# Altium schematic sheet HHT_CAL_PWR_3.1_20170407.SchDoc
size A1
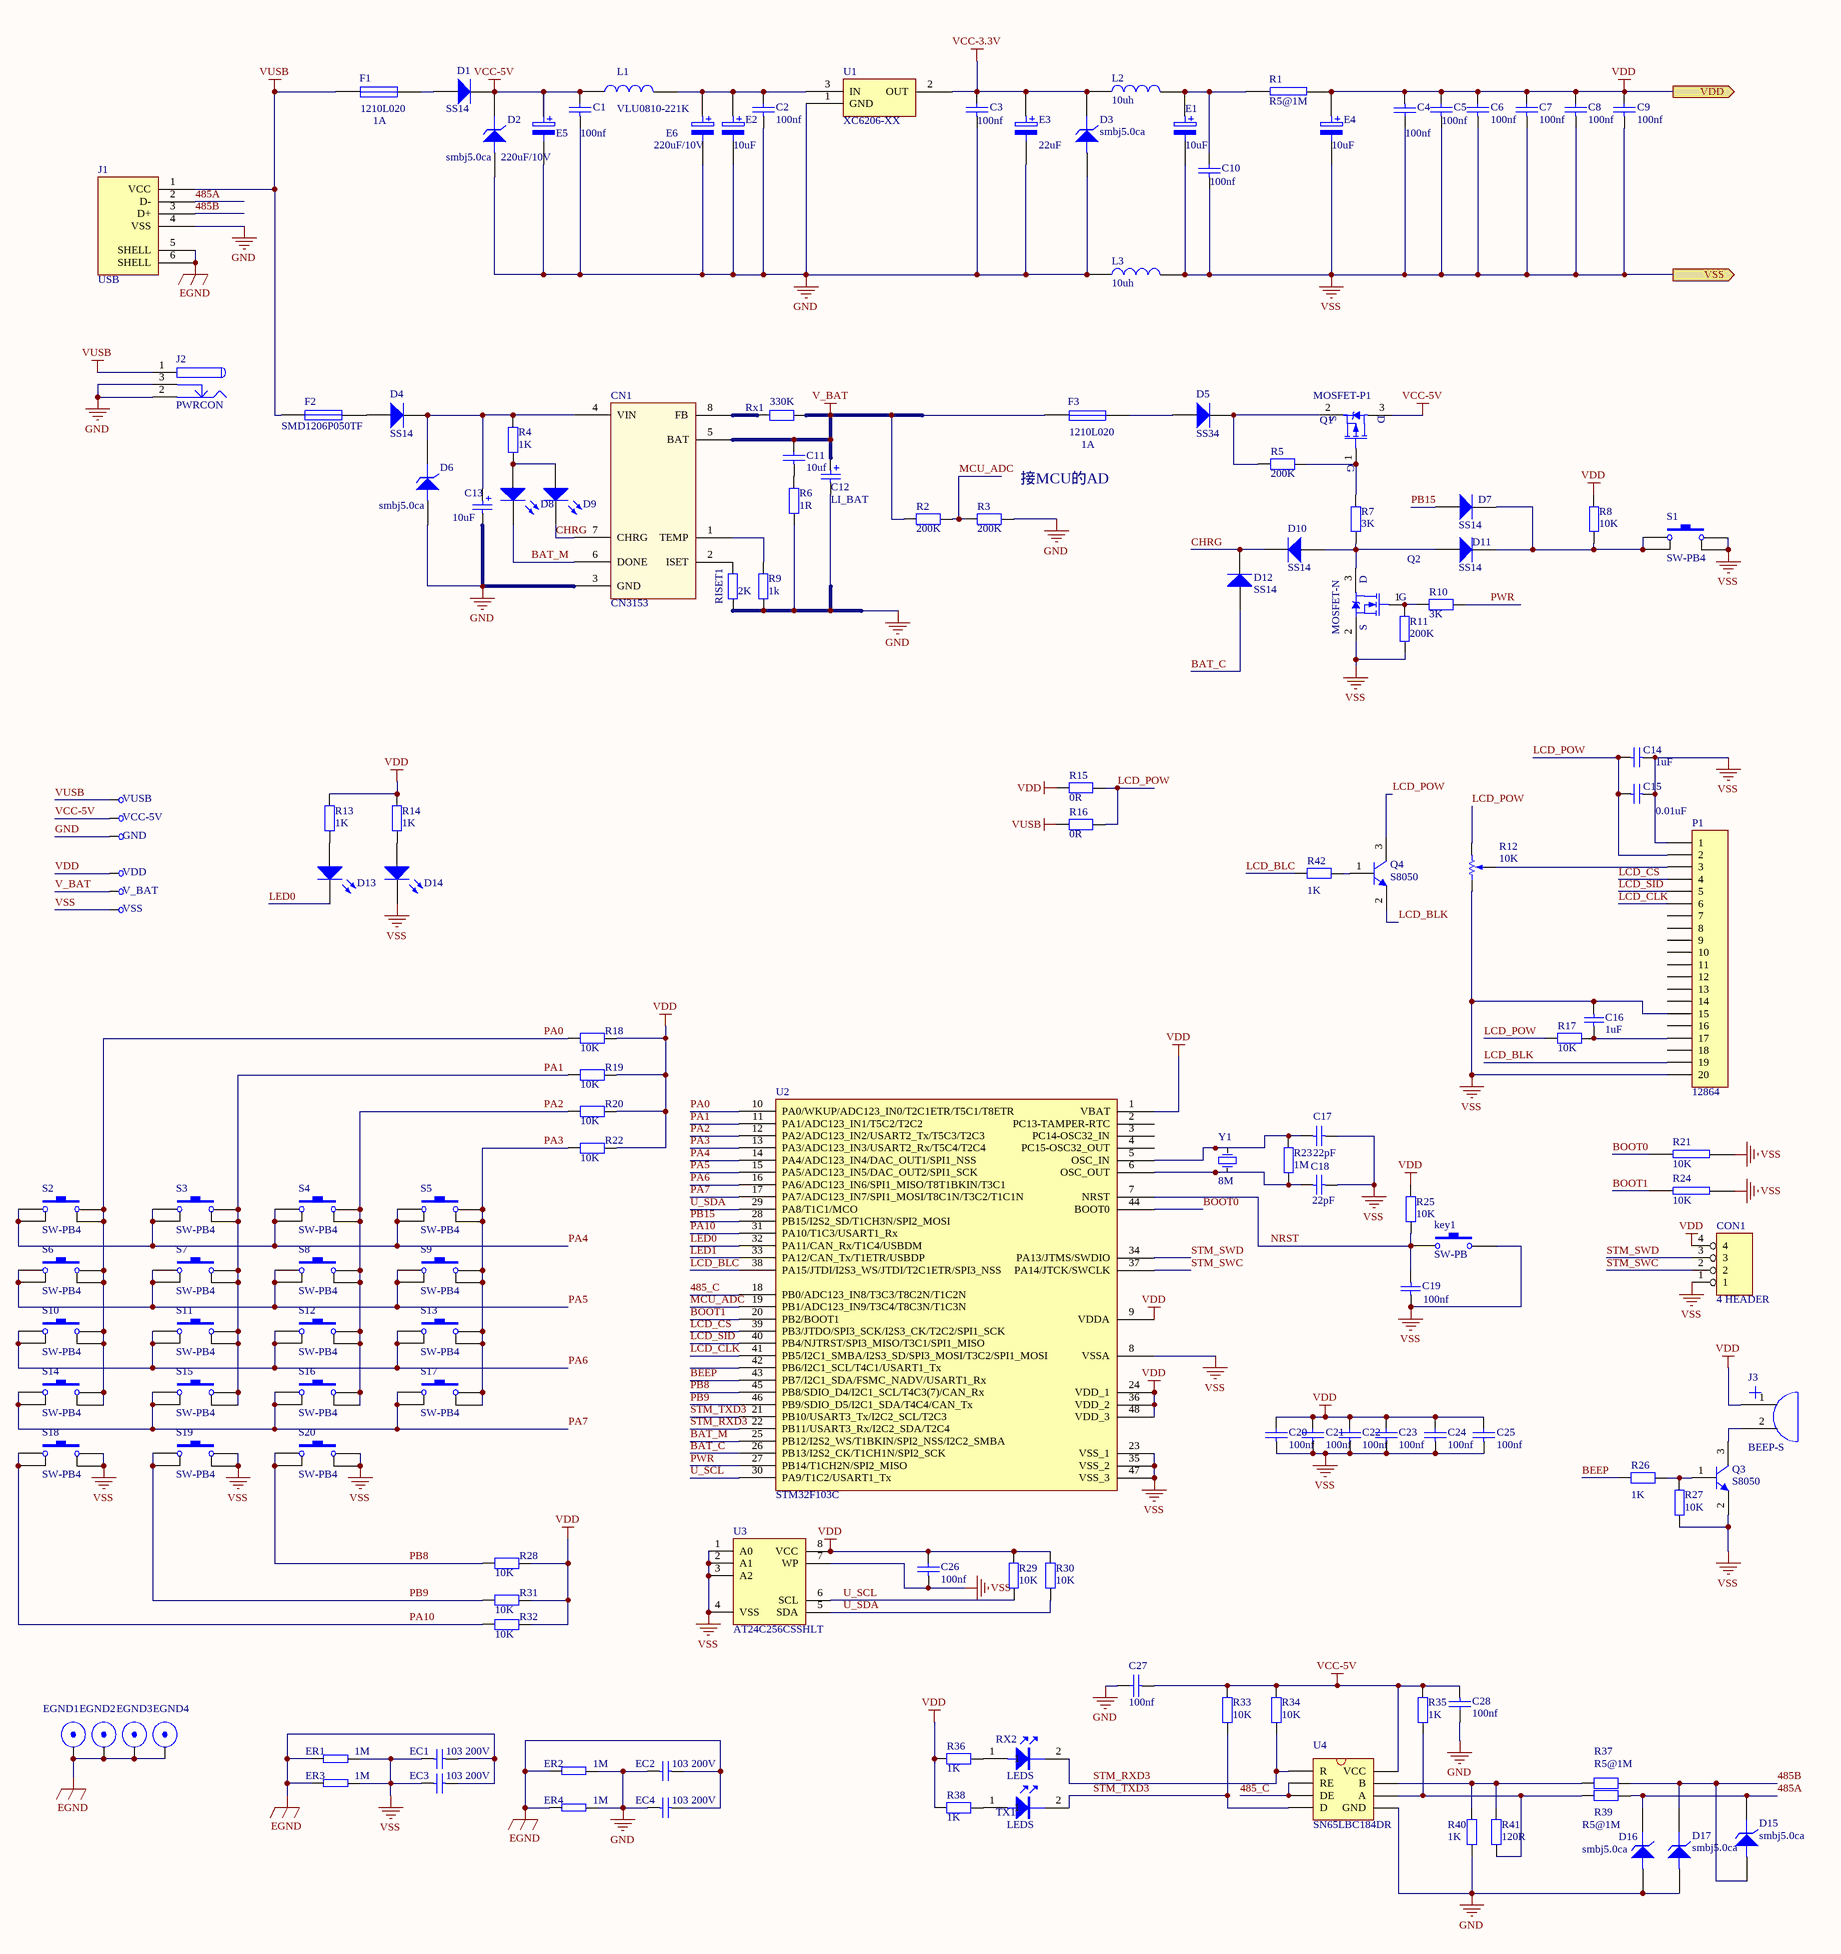
[diagram p0: HHT_CAL_PWR_3.1_20170407.SchDoc]

## Parts
C1  100nf  [LC-0805_C]
C2  100nf  [LC-0603_C]
C3  100nf  [LC-0603_C]
C4  100nf  [LC-0603_C]
C5  100nf  [LC-0603_C]
C6  100nf  [LC-0603_C]
C7  100nf  [LC-0603_C]
C8  100nf  [LC-0603_C]
C9  100nf  [LC-0603_C]
C10  100nf  [LC-0603_C]
C11  10uf  [LC-CASE-A_3216]
C12  LI_BAT  [HDR2X1-2.54]
C13  value 10uF  [LC-CASE-B_3528]  (hidden comment: 100uF)
C14  1uf  [LC-0603_C]
C15  0.01uF  [LC-0603_C]
C16  1uF  [LC-0603_C]
C17  22PF  [LC-0603_C]
C18  22PF  [LC-0603_C]
C19  100nf  [LC-0603_C]
C20  100nf  [LC-0603_C]
C21  100nf  [LC-0603_C]
C22  100nf  [LC-0603_C]
C23  100nf  [LC-0603_C]
C24  100nf  [LC-0603_C]
C25  100nf  [LC-0603_C]
C26  100nf  [LC-0603_C]
C27  100nf  [LC-0603_C]
C28  100nf  [LC-0603_C]
CN1  CN3153  [SOIC8]
CON1  4 HEADER  [sip4]
D1  SS14  [LC-SMA(DO-214AC)_S5]
D2  smbj5.0ca  [LC-SMB(DO-214AA)_S1]
D3  smbj5.0ca  [LC-SMB(DO-214AA)_S1]
D4  SS14  [LC-SMA(DO-214AC)_S5]
D5  SS34  [LC-SMA(DO-214AC)_S5]
D6  smbj5.0ca  [LC-SMA(DO-214AC)_S5]
D7  SS14  [LC-SMA(DO-214AC)_S5]
D8  LED0  [LED-0805]  (value not drawn)
D9  LED0  [LED-0805]  (value not drawn)
D10  SS14  [LC-SMA(DO-214AC)_S5]
D11  SS14  [LC-SMA(DO-214AC)_S5]
D12  SS14  [LC-SMA(DO-214AC)_S5]
D13  LED0  [LC-0805_LED_S1]  (value not drawn)
D14  LED0  [LC-0805_LED_S1]  (value not drawn)
D15  smbj5.0ca  [LC-SMB(DO-214AA)_S1]
D16  smbj5.0ca  [LC-SMB(DO-214AA)_S1]
D17  smbj5.0ca  [LC-SMB(DO-214AA)_S1]
E1  10uF  [LC-CASE-A_3216]
E2  10uF  [LC-CASE-B_3528]
E3  22uF  [HONOR_63X54]
E4  10uF  [LC-CASE-A_3216]
E5  220uF/10V  [HONOR_63X54]
E6  220uF/10V  [HONOR_63X54]
EC1  103 200V  [LC-1206_C]
EC2  103 200V  [LC-1206_C]
EC3  103 200V  [LC-1206_C]
EC4  103 200V  [LC-1206_C]
EGND1  EGND  [H-6-3.2m]  (value not drawn)
EGND2  EGND  [H-6-3.2m]  (value not drawn)
EGND3  EGND  [H-6-3.2m]  (value not drawn)
EGND4  EGND  [H-6-3.2m]  (value not drawn)
ER1  1M  [LC-1206_R]
ER2  1M  [LC-1206_R]
ER3  1M  [LC-1206_R]
ER4  1M  [LC-1206_R]
F1  1210L020  value 1A  [LC-0805_R]
F2  SMD1206P050TF  [LC-1206_R]
F3  1210L020  value 1A  [LC-0805_R]
GND  CHECK  [CHECK-B]  (value not drawn)
J1  USB  [USB-4-A]
J2  PWRCON  [DC-005]
J3  BEEP-S  [BEEP-S]
key1  SW-PB  [SW_PB2_C1]
L1  VLU0810-221K  [L-SMD-7]
L2  10uh  [LC-0805_L]
L3  10uh  [LC-0805_L]
P1  12864  [HDR1X20]
Q1  MOSFET-P1  [SOT23-3]
Q2  MOSFET-N  [LC-SOT-23(SOT-23-3)]
Q3  S8050  [SOT23-3]
Q4  S8050  [SOT23-3]
R1  R5@1M  [LC-0805_R]
R2  200K  [LC-0603_R]
R3  200K  [LC-0603_R]
R4  1K  [LC-0603_R]
R5  200K  [LC-0603_R]
R6  1R  [LC-0603_R]
R7  3K  [LC-0603_R]
R8  10K  [LC-0603_R]
R9  1k  [LC-0603_R]
R10  3K  [LC-0603_R]
R11  200K  [LC-0603_R]
R12  value 10K  [VR-3296W]  (hidden comment: RPot)
R13  1K  [0805-1]
R14  1K  [0805-1]
R15  0R  [LC-0805_R]
R16  0R  [LC-0805_R]
R17  10K  [0603-1]
R18  10K  [LC-0603_R]
R19  10K  [LC-0603_R]
R20  10K  [LC-0603_R]
R21  10K  [LC-0603_R]
R22  10K  [LC-0603_R]
R23  1M  [0603-1]
R24  10K  [LC-0603_R]
R25  10K  [LC-0603_R]
R26  1K  [LC-0603_R]
R27  10k  [LC-0603_R]
R28  10K  [LC-0603_R]
R29  10K  [LC-0603_R]
R30  10K  [LC-0603_R]
R31  10K  [LC-0603_R]
R32  10K  [LC-0603_R]
R33  10K  [LC-0603_r]
R34  10K  [LC-0603_r]
R35  1K  [LC-0603_R]
R36  1K  [LC-0603_R]
R37  R5@1M  [LC-0805_R]
R38  1K  [LC-0603_R]
R39  R5@1M  [LC-0805_R]
R40  1K  [LC-0603_R]
R41  120R  [LC-0603_R]
R42  1K  [LC-0603_R]
RISET1  2K  [LC-0603_R]
Rx1  330K  [LC-0603_R]
RX2  LEDS  [LC-0805_LED_S1]
S1  SW-PB4  [金属轻触开关]
S2  SW-PB4  [金属轻触开关]
S3  SW-PB4  [金属轻触开关]
S4  SW-PB4  [金属轻触开关]
S5  SW-PB4  [金属轻触开关]
S6  SW-PB4  [金属轻触开关]
S7  SW-PB4  [金属轻触开关]
S8  SW-PB4  [金属轻触开关]
S9  SW-PB4  [金属轻触开关]
S10  SW-PB4  [金属轻触开关]
S11  SW-PB4  [金属轻触开关]
S12  SW-PB4  [金属轻触开关]
S13  SW-PB4  [金属轻触开关]
S14  SW-PB4  [金属轻触开关]
S15  SW-PB4  [金属轻触开关]
S16  SW-PB4  [金属轻触开关]
S17  SW-PB4  [金属轻触开关]
S18  SW-PB4  [金属轻触开关]
S19  SW-PB4  [金属轻触开关]
S20  SW-PB4  [金属轻触开关]
TX1  LEDS  [LC-0805_LED_S1]
U1  XC6206-XX  [LC-SOT-23(SOT-23-3)]
U2  STM32F103C  [LC-LQFP-48_7x7x05P]
U3  AT24C256CSSHLT  [SOIC-8]
U4  SN65LBC184DR  [soic-8]
V_BAT  CHECK  [CHECK-B]  (value not drawn)
VCC-5V  CHECK  [CHECK-B]  (value not drawn)
VDD  CHECK  [CHECK-B]  (value not drawn)
VSS  CHECK  [CHECK-B]  (value not drawn)
VUSB  CHECK  [CHECK-B]  (value not drawn)
Y1  value 8M  [X-SM49]  (hidden comment: XTAL)

## Ports
VDD (out), VSS (out)

## Nets
EGND: EC1.1 EC2.1 EC3.1 EC4.1 EGND1.0 EGND2.0 EGND3.0 EGND4.0 ER1.1 ER2.1 ER3.1 ER4.1 J1.5(SHELL) J1.6(SHELL)
GND: C1.1 C2.1 C3.1 C12.2 C13.2 C27.2 C28.2 CN1.3(GND) D2.1(A) D3.1(A) D6.1(A) D16.1(A) D17.1(A) E2.2 E3.2 E5.2 E6.2 EC2.2 EC4.2 ER2.2 ER4.2 GND.1 J1.4(VSS) J2.2 J2.3 L3.1 R3.2 R6.2 R9.2 R40.1 RISET1.2 U1.1(GND) U4.5(GND)
V_BAT: C11.2 C12.1 CN1.5(BAT) F3.1 R2.1 Rx1.1 V_BAT.1
VCC-3.3V: C3.2 D3.2(K) E3.1 L2.1 U1.2(OUT)
VCC-5V: C1.2 C27.1 C28.1 D1.2(K) D2.2(K) E5.1 L1.1 Q1.3(D) R33.2 R34.2 R35.2 U4.8(VCC) VCC-5V.1
VDD: C4.1 C5.2 C6.2 C7.2 C8.2 C9.2 C20.2 C21.2 C22.2 C23.2 C24.2 C25.2 C26.2 CON1.4 E4.1 J3.1 R1.1 R8.2 R13.2 R14.2 R15.1 R18.2 R19.2 R20.2 R22.2 R25.2 R28.2 R29.1 R30.1 R31.2 R32.2 R36.1 R38.1 U2.1(VBAT) U2.9(VDDA) U2.24(VDD_1) U2.36(VDD_2) U2.48(VDD_3) U3.8(VCC) VDD.1 ; port VDD
VSS: C4.2 C5.1 C6.1 C7.1 C8.1 C9.1 C10.1 C14.2 C15.2 C16.2 C17.2 C18.2 C19.1 C20.1 C21.1 C22.1 C23.1 C24.1 C25.1 C26.1 CON1.1 D14.2(K) E1.2 E4.2 EC1.2 EC3.2 ER1.2 ER3.2 key1.2 L3.2 P1.1 P1.15 P1.20 Q2.2(S) Q3.2(E) R11.1 R12.1(TOP) R21.1 R24.1 R27.1 S1.2 S1.3 S18.2 S18.3 S19.2 S19.3 S20.2 S20.3 U2.8(VSSA) U2.23(VSS_1) U2.35(VSS_2) U2.47(VSS_3) U3.1(A0) U3.2(A1) U3.3(A2) U3.4(VSS) U3.7(WP) VSS.1 ; port VSS
VUSB: F1.1 F2.2 J1.1(VCC) J2.1 R16.1 VUSB.1
485_C: U2.18(PB0/ADC123_IN8/T3C3/T8C2N/T1C2N) U4.2(RE) U4.3(DE)
485A: D15.2(K) D16.2(K) J1.2(D-) R39.1
485B: D15.1(A) D17.2(K) J1.3(D+) R37.1
BAT_C: D12.1(A) U2.26(PB13/I2S2_CK/T1CH1N/SPI2_SCK)
BAT_M: CN1.6(DONE) D8.2(K) U2.25(PB12/I2S2_WS/T1BKIN/SPI2_NSS/I2C2_SMBA)
BEEP: R26.1 U2.43(PB7/I2C1_SDA/FSMC_NADV/USART1_Rx)
BOOT0: R21.2 U2.44(BOOT0)
BOOT1: R24.2 U2.20(PB2/BOOT1)
CHRG: CN1.7(CHRG) D9.2(K) D10.2(K) D12.2(K)
LCD_BLC: R42.1 U2.38(PA15/JTDI/I2S3_WS/JTDI/T2C1ETR/SPI3_NSS)
LCD_BLK: P1.19 Q4.2(E)
LCD_CLK: P1.6 U2.41(PB5/I2C1_SMBA/I2S3_SD/SPI3_MOSI/T3C2/SPI1_MOSI)
LCD_CS: P1.4 U2.39(PB3/JTDO/SPI3_SCK/I2S3_CK/T2C2/SPI1_SCK)
LCD_POW: C14.1 C15.1 P1.2 Q4.3(C) R12.3(BOT) R15.2 R16.2 R17.1
LCD_SID: P1.5 U2.40(PB4/NJTRST/SPI3_MISO/T3C1/SPI1_MISO)
LED0: D13.2(K) U2.32(PA11/CAN_Rx/T1C4/USBDM)
LED1: U2.33(PA12/CAN_Tx/T1ETR/USBDP)
MCU_ADC: R2.2 R3.1 U2.19(PB1/ADC123_IN9/T3C4/T8C3N/T1C3N)
NRST: C19.2 key1.1 R25.1 U2.7(NRST)
PA0: R18.1 S2.2 S2.3 S6.2 S6.3 S10.2 S10.3 S14.2 S14.3 U2.10(PA0/WKUP/ADC123_IN0/T2C1ETR/T5C1/T8ETR)
PA1: R19.1 S3.2 S3.3 S7.2 S7.3 S11.2 S11.3 S15.2 S15.3 U2.11(PA1/ADC123_IN1/T5C2/T2C2)
PA2: R20.1 S4.2 S4.3 S8.2 S8.3 S12.2 S12.3 S16.2 S16.3 U2.12(PA2/ADC123_IN2/USART2_Tx/T5C3/T2C3)
PA3: R22.1 S5.2 S5.3 S9.2 S9.3 S13.2 S13.3 S17.2 S17.3 U2.13(PA3/ADC123_IN3/USART2_Rx/T5C4/T2C4)
PA4: S2.1 S2.4 S3.1 S3.4 S4.1 S4.4 S5.1 S5.4 U2.14(PA4/ADC123_IN4/DAC_OUT1/SPI1_NSS)
PA5: S6.1 S6.4 S7.1 S7.4 S8.1 S8.4 S9.1 S9.4 U2.15(PA5/ADC123_IN5/DAC_OUT2/SPI1_SCK)
PA6: S10.1 S10.4 S11.1 S11.4 S12.1 S12.4 S13.1 S13.4 U2.16(PA6/ADC123_IN6/SPI1_MISO/T8T1BKIN/T3C1)
PA7: S14.1 S14.4 S15.1 S15.4 S16.1 S16.4 S17.1 S17.4 U2.17(PA7/ADC123_IN7/SPI1_MOSI/T8C1N/T3C2/T1C1N)
PA10: R32.1 S18.1 S18.4 U2.31(PA10/T1C3/USART1_Rx)
PB8: R28.1 S20.1 S20.4 U2.45(PB8/SDIO_D4/I2C1_SCL/T4C3(7)/CAN_Rx)
PB9: R31.1 S19.1 S19.4 U2.46(PB9/SDIO_D5/I2C1_SDA/T4C4/CAN_Tx)
PB15: D7.1(A) U2.28(PB15/I2S2_SD/T1CH3N/SPI2_MOSI)
PWR: R10.1 U2.27(PB14/T1CH2N/SPI2_MISO)
STM_RXD3: R34.1 RX2.2 U2.22(PB11/USART3_Rx/I2C2_SDA/T2C4) U4.1(R)
STM_SWC: CON1.2 U2.37(PA14/JTCK/SWCLK)
STM_SWD: CON1.3 U2.34(PA13/JTMS/SWDIO)
STM_TXD3: R33.1 TX1.2 U2.21(PB10/USART3_Tx/I2C2_SCL/T2C3) U4.4(D)
U_SCL: R29.2 U2.30(PA9/T1C2/USART1_Tx) U3.6(SCL)
U_SDA: R30.2 U2.29(PA8/T1C1/MCO) U3.5(SDA)
NetC2_2: C2.2 E2.1 E6.1 L1.2 U1.3(IN)
NetC10_2: C10.2 E1.1 L2.2 R1.2
NetC11_1: C11.1 R6.1
NetC13_1: C13.1 CN1.4(VIN) D4.2(K) D6.2(K) R4.2
NetC16_1: C16.1 P1.17 R17.2
NetC17_1: C17.1 R23.2 U2.5(OSC_IN) Y1.1(OSC1)
NetC18_1: C18.1 R23.1 U2.6(OSC_OUT) Y1.2(OSC2)
NetCN1_1: CN1.1(TEMP) R9.1
NetCN1_2: CN1.2(ISET) RISET1.1
NetCN1_8: CN1.8(FB) Rx1.2
NetD1_1: D1.1(A) F1.2
NetD4_1: D4.1(A) F2.1
NetD5_1: D5.1(A) F3.2
NetD5_2: D5.2(K) Q1.2(S) R5.1
NetD7_2: D7.2(K) D11.2(K) R8.1 S1.1 S1.4
NetD8_1: D8.1(A) D9.1(A) R4.1
NetD10_1: D10.1(A) D11.1(A) Q2.3(D) R7.1
NetD13_1: D13.1(A) R13.1
NetD14_1: D14.1(A) R14.1
NetJ3_2: J3.2 Q3.3(C)
NetP1_3: P1.3 R12.2(TAP)
NetQ1_1: Q1.1(G) R5.2 R7.2
NetQ2_1: Q2.1(G) R10.2 R11.2
NetQ3_1: Q3.1(B) R26.2 R27.2
NetQ4_1: Q4.1(B) R42.2
NetR35_1: R35.1 R39.2 R41.1 U4.6(A)
NetR36_2: R36.2 RX2.1
NetR37_2: R37.2 R40.2 R41.2 U4.7(B)
NetR38_2: R38.2 TX1.1

Not connected (* = marked no-connect by the designer): P1 7 8 9 10 11 12 13 14 16 18; U2 2(PC13-TAMPER-RTC) 3(PC14-OSC32_IN) 4(PC15-OSC32_OUT) 42(PB6/I2C1_SCL/T4C1/USART1_Tx)

## Notes on the sheet
- 接MCU的AD

## Library data of the parts
C1-C11 C20-C28 = CAP: Capacitor
C12 = Cap Pol1: Polarized Capacitor (Radial); Value: 10F; Published: 8-Jun-2000; Revision: July-2002: Re-released for DXP Platform.; Publisher: Altium Limited
C13 = Cap Pol1: Polarized Capacitor (Radial); Published: 8-Jun-2000; Revision: July-2002: Re-released for DXP Platform.; Publisher: Altium Limited
C14-C18 = Cap-S: 贴片瓷片电容; Published: 8-Jun-2000; LatestRevisionDate: 17-Jul-2002; LatestRevisionNote: Re-released for DXP Platform.; PackageReference: RAD-0.3; Publisher: Altium Limited
  C14 C16: Value: 1uF
  C15: Value: 0.01uF
  C17 C18: Value: 22pF
C19 = Cap: Capacitor; Value: 0.1uF; Published: 8-Jun-2000; LatestRevisionDate: 17-Jul-2002; LatestRevisionNote: Re-released for DXP Platform.; PackageReference: RAD-0.3; Publisher: Altium Limited
CON1 = 4 HEADER: 4 Pin Header
D1 = Diode-R: 整流二极管; Published: 8-Jun-2000; LatestRevisionDate: 17-Jul-2002; LatestRevisionNote: Re-released for DXP Platform.; PackageDocument: Sep-1996; PackageReference: SMC; Publisher: Altium Limited
D2 D3 D6 D15-D17 = ZENER3: Zener Diode
D4 D5 D7 D10-D12 = Diode: Default Diode; Published: 8-Jun-2000; LatestRevisionDate: 17-Jul-2002; LatestRevisionNote: Re-released for DXP Platform.; PackageDocument: Sep-1996; PackageReference: SMC; Publisher: Altium Limited; Code_JEDEC: DO-214-AB
D8 D9 D13 D14 = LED0: 发光二极管; Published: 8-Jun-2000; LatestRevisionDate: 08-Jul-2005; LatestRevisionNote: Mech Layer 1 removed.; PackageReference: LED-0; Publisher: Altium Limited
E1-E6 = ELECTRO2: Electrolytic Capacitor
EC1-EC4 = Cap: Capacitor; Value: 103; Published: 8-Jun-2000; Revision: July-2002: Re-released for DXP Platform.; Publisher: Altium Limited
ER1-ER4 R1 R21 R24 = RES2
F1 F3 = F: 保险丝
F2 = Fuse 1: Fuse; Published: 8-Jun-2000; LatestRevisionDate: 17-Jul-2002; LatestRevisionNote: Re-released for DXP Platform.; PackageReference: PIN-W2/E2.8; Publisher: Altium Limited
GND V_BAT VCC-5V VDD VSS VUSB = CHECK: 测试点
J1 = USB: USB接口
J2 = PWRCON: 直流电源端子; Published: 17-Dec-2003; DatasheetDocument: 09-May-2002; Publisher: Altium Limited; ComponentLink1Description: Manufacturer Link; ComponentLink1URL: http://domino.kycon.com/internet/Products.html
J3 = BE: 有源蜂鸣器
key1 = SW-PB: 微动开关; Published: 24-Mar-1999; LatestRevisionDate: 17-Jul-2002; LatestRevisionNote: Re-released for DXP Platform.; PackageReference: SPST-2; Publisher: Altium Limited
L1-L3 = INDUCTOR
P1 = Header 20: Header, 20-Pin; LatestRevisionDate: 17-Jul-2002; LatestRevisionNote: Re-released for DXP Platform.; Publisher: Altium Limited
Q2 = MOSFET-N: N-Channel MOSFET; PackageDocument: 1995/1996; Published: 8-Jun-2000; LatestRevisionDate: 17-Jul-2002; LatestRevisionNote: Re-released for DXP Platform.; PackageReference: E3; Publisher: Altium Limited
Q3 Q4 = NPN1: 贴片三极管; Published: 8-Jun-2000; LatestRevisionDate: 15-Jan-2003; LatestRevisionNote: PCB Footprint 'BCY-W3/D4.7' replaced; DatasheetDocument: 1997; PackageDocument: Sep-1998; PackageReference: TO-92A; Publisher: Altium Limited; Code_JEDEC: TO-92A; ComponentLink1Description: Manufacturer Link; ComponentLink1URL: http://www.fairchildsemi.com/; ComponentLink2Description: Datasheet; ComponentLink2URL: http://www.fairchildsemi.com/ds/2N%2F2N3904.pdf
R2 R3 R5 R7 R10 R11 R35-R41 = Res2: Resistor; Value: 10K; Published: 8-Jun-2000; LatestRevisionDate: 17-Jul-2002; LatestRevisionNote: Re-released for DXP Platform.; PackageReference: AXIAL-0.4; Publisher: Altium Limited
R4 R25 R29 R30 R33 R34 RISET1 Rx1 = Res2: Resistor; Published: 8-Jun-2000; LatestRevisionDate: 17-Jul-2002; LatestRevisionNote: Re-released for DXP Platform.; PackageReference: AXIAL-0.4; Publisher: Altium Limited
  R4: Value: 1K
  R25 R29 R30 R33 R34: Value: 10K
  RISET1: Value: 2K
  Rx1: Value: 330K
R6 R9 = Res2: Resistor; Value: 330K; Published: 8-Jun-2000; LatestRevisionDate: 17-Jul-2002; LatestRevisionNote: Re-released for DXP Platform.; PackageReference: AXIAL-0.4; Publisher: Altium Limited
R8 R13 R14 R17-R20 R22 R23 R26-R28 R31 R32 R42 = R: 贴片电阻; Published: 8-Jun-2000; LatestRevisionDate: 17-Jul-2002; LatestRevisionNote: Re-released for DXP Platform.; PackageReference: AXIAL-0.4; Publisher: Altium Limited
  R8 R17-R20 R22 R27 R28 R31 R32: Value: 10K
  R13 R14 R26 R42: Value: 1K
  R23: Value: 1M
R12 = RPot: 精密可调电阻; Sim Note: Enter the Resistance value and the set point into parameter fields.; Set Position: 0.5; Published: 8-Jun-2000; LatestRevisionDate: 17-Jul-2002; LatestRevisionNote: Re-released for DXP Platform.; PackageReference: VR5; Publisher: Altium Limited
R15 R16 = Res1: 贴片电阻; Published: 8-Jun-2000; LatestRevisionDate: 17-Jul-2002; LatestRevisionNote: Re-released for DXP Platform.; PackageReference: AXIAL-0.4; Publisher: Altium Limited; Value: 0R
S1-S20 = SW-: 微动开关; Published: 24-Mar-1999; LatestRevisionDate: 17-Jul-2002; LatestRevisionNote: Re-released for DXP Platform.; PackageReference: SPST-2; Publisher: Altium Limited
U2 = STM32F103C: STM32单片机48引脚
U3 = AT24C02: EEROM存储器
U4 = 75176B
Y1 = XTA: 晶振; Published: 8-Jun-2000; LatestRevisionDate: 17-Jul-2002; LatestRevisionNote: Re-released for DXP Platform.; PackageReference: R38; Publisher: Altium Limited